# Altium project SlimeVR_REVTT.PrjPcb
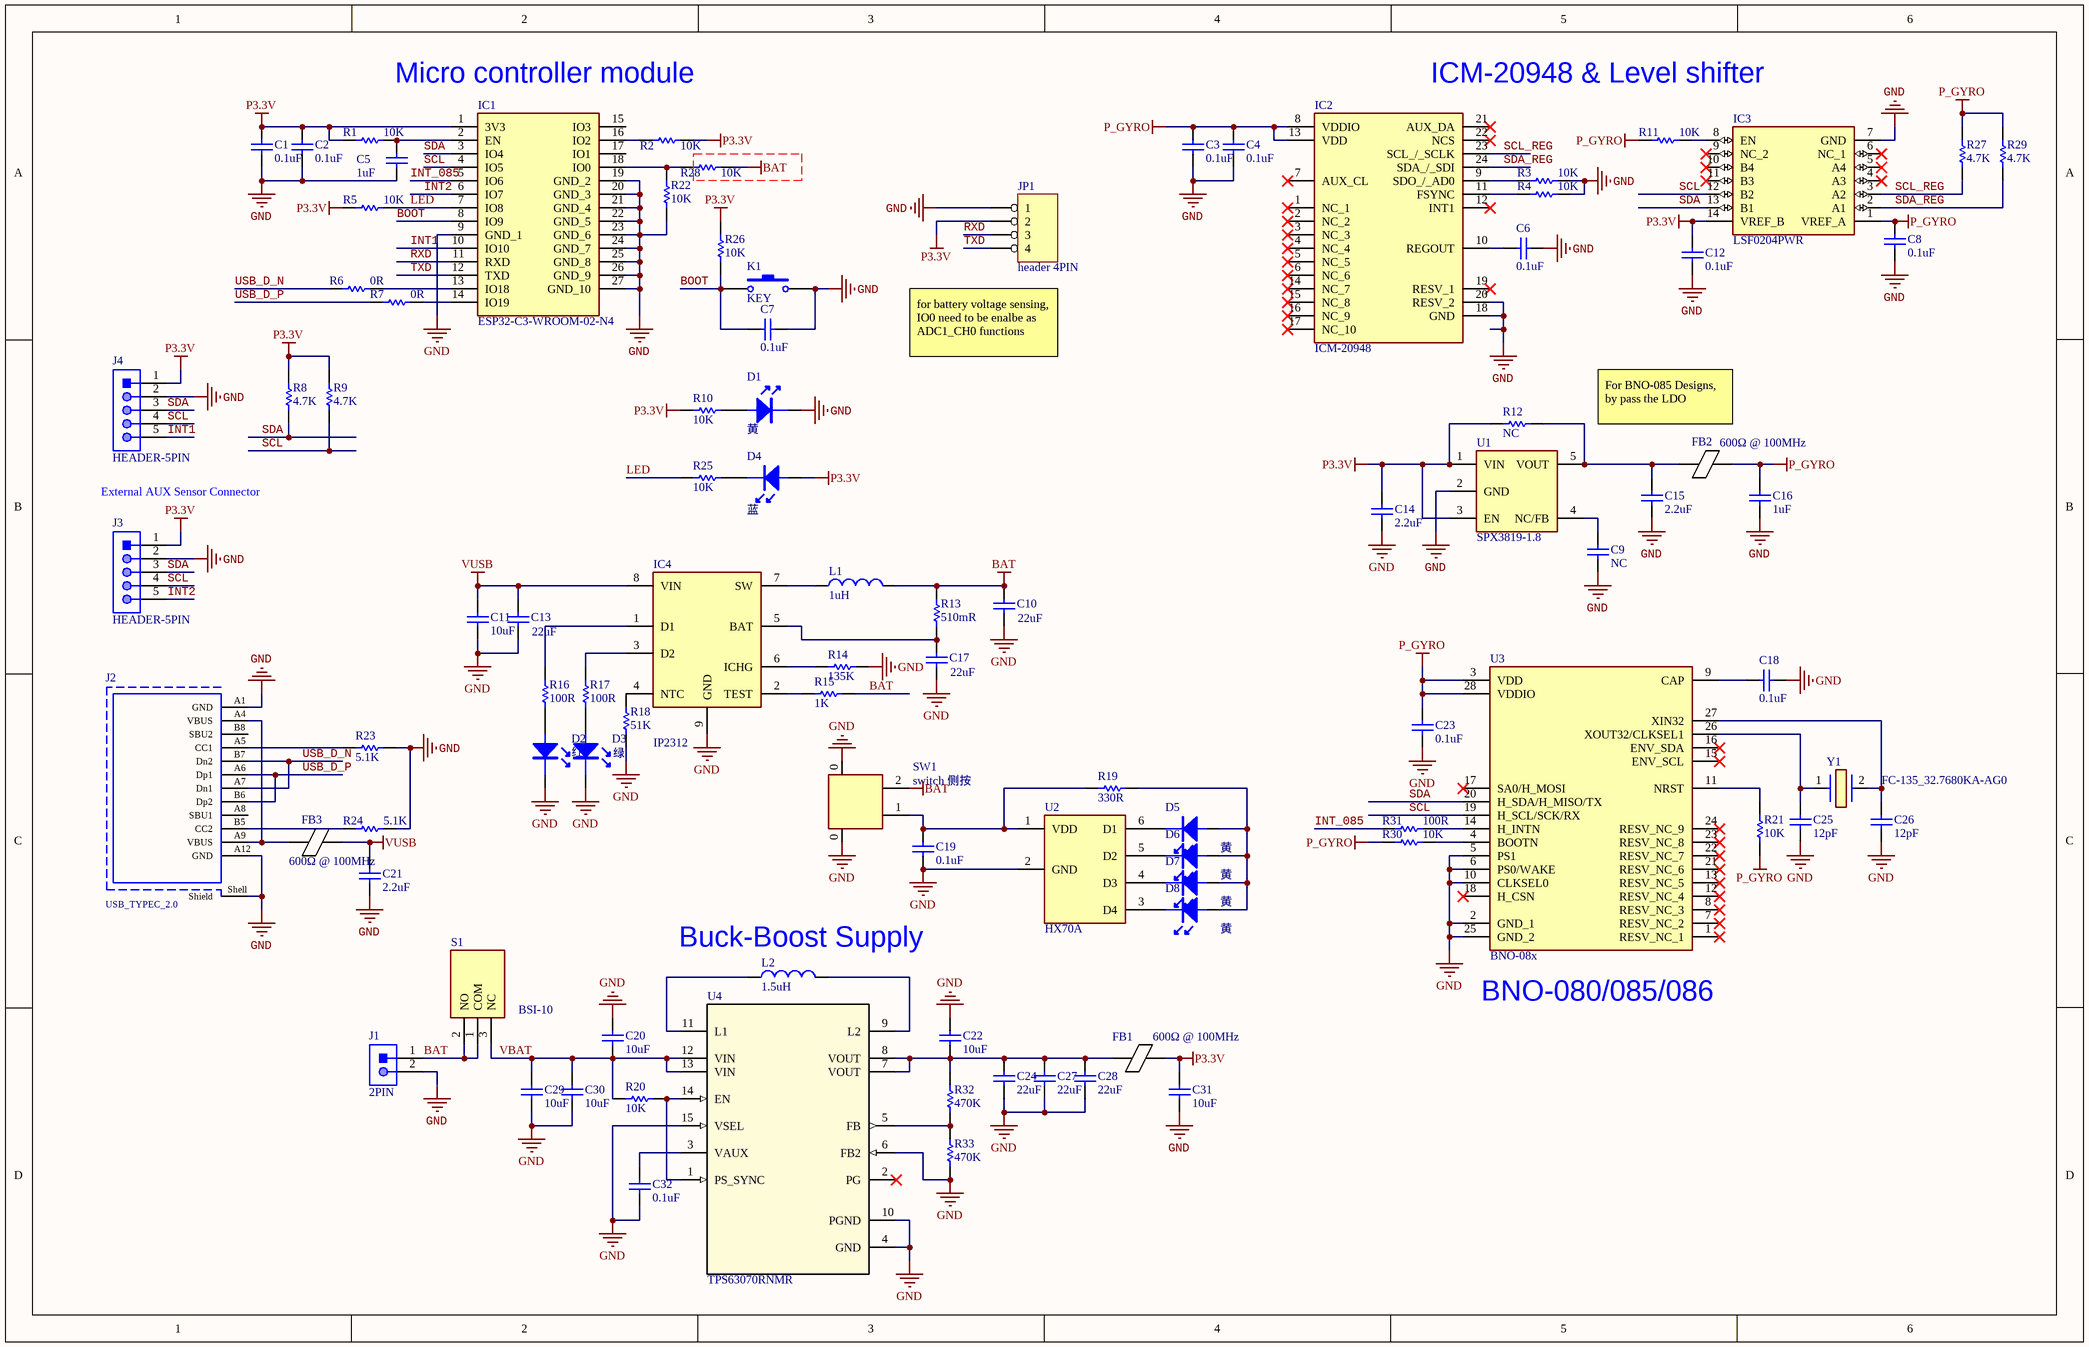
[diagram p0: SVR_REVTT_1.3.SchDoc]
1 sheet, 95 parts. Net scope: global (net labels, ports and power ports of the same name join across sheets).
Board file: SLMVRtt_REV1.3_MH.PcbDoc

## Sheet SVR_REVTT_1.3.SchDoc
size OrCAD B

### Parts
C1  0.1uF  [0402L]
C2  0.1uF  [0402L]
C3  0.1uF  [0402L]
C4  0.1uF  [0402L]
C5  1uF  [0402L]
C6  0.1uF  [0402L]
C7  0.1uF  [0402L]
C8  0.1uF  [0402L]
C9  NC  [0603_C]
C10  22uF  [0805]
C11  10uF  [0805]
C12  0.1uF  [0402L]
C13  22uF  [0805]
C14  2.2uF  [0603_C]
C15  2.2uF  [0603_C]
C16  1uF  [0603_C]
C17  22uF  [0805]
C18  0.1uF  [0402L]
C19  0.1uF  [0402L]
C20  10uF  [0603_C]
C21  2.2uF  [0603_C]
C22  10uF  [0603_C]
C23  0.1uF  [0402L]
C24  22uF  [0805]
C25  12pF  [0402L]
C26  12pF  [0402L]
C27  22uF  [0805]
C28  22uF  [0805]
C29  10uF  [0805]
C30  10uF  [0805]
C31  10uF  [0805]
C32  0.1uF  [0402L]
D1  黄  [0603_LED]
D2  红  [0603_LED]
D3  绿  [0603_LED]
D4  蓝  [0603_LED]
D5  黄  [0603_LED]
D6  黄  [0603_LED]
D7  黄  [0603_LED]
D8  黄  [0603_LED]
FB1  600Ω @ 100MHz  [0805]
FB2  600Ω @ 100MHz  [0603]
FB3  600Ω @ 100MHz  [0603]
IC1  ESP32-C3-WROOM-02-N4  [ESP32C3WROOM02N4]
IC2  ICM-20948  [QFN40P300X300X105-25N-D]
IC3  LSF0204PWR  [SOP65P640X120-14N]
IC4  IP2312  [SOIC-8N]
J1  2PIN  [XH2.54-WI-2P]
J2  USB_TYPEC_2.0  [USB_TYPEC_2.0_Horizontal_SMT]
J3  HEADER-5PIN  [HEADER_5P_1.25_RT]
J4  HEADER-5PIN  [HEADER_5P_1.25_RT]
JP1  header 4PIN  [header4]
K1  KEY  [KEY_2]
L1  value 1uH  [Inductor  SLO0650]  (hidden comment: INDUCTOR)
L2  value 1.5uH  [Inductor  SMNR4020]  (hidden comment: INDUCTOR)
R1  10K  [0402L]
R2  10K  [0402L]
R3  10K  [0402L]
R4  10K  [0402L]
R5  10K  [0402L]
R6  0R  [0402L]
R7  0R  [0402L]
R8  4.7K  [0402L]
R9  4.7K  [0402L]
R10  10K  [0402L]
R11  10K  [0402L]
R12  NC  [0603]
R13  510mR  [0603L]
R14  135K  [0402L]
R15  1K  [0402L]
R16  100R  [0402L]
R17  100R  [0402L]
R18  51K  [0402L]
R19  330R  [0603_R]
R20  10K  [0402L]
R21  10K  [0402L]
R22  10K  [0402L]
R23  5.1K  [0402L]
R24  5.1K  [0402L]
R25  10K  [0402L]
R26  10K  [0402L]
R27  4.7K  [0402L]
R28  10K  [0402L]
R29  4.7K  [0402L]
R30  10K  [0402L]
R31  100R  [0402L]
R32  470K  [0402L]
R33  470K  [0402L]
S1  BSI-10  [BSI10]
SW1  switch 侧按  [TSW 3*6*4.3-S-W]
U1  SPX3819-1.8  [SOT-23-5]
U2  HX70A  [SOT95P250X110-6N]
U3  BNO-08x  [BNO085]
U4  TPS63070RNMR  [RNM0015A]
Y1  FC-135_32.7680KA-AG0  [FC135327680KAAG0]

### Nets
BAT: C10.2 J1.1 L1.2 R13.2 R15.2 R28.2 S1.1(COM) S1.2(NO) SW1.2
GND: C1.1 C2.1 C3.2 C4.2 C5.1 C6.1 C7.2 C8.2 C9.1 C10.1 C11.1 C12.2 C13.1 C14.1 C15.1 C16.1 C17.1 C18.1 C19.1 C20.2 C21.1 C22.2 C23.1 C24.2 C25.1 C26.1 C27.2 C28.2 C29.1 C30.1 C31.1 C32.1 D1.1(K) D2.1(K) D3.1(K) IC1.9(GND_1) IC1.19(GND_2) IC1.20(GND_3) IC1.21(GND_4) IC1.22(GND_5) IC1.23(GND_6) IC1.24(GND_7) IC1.25(GND_8) IC1.26(GND_9) IC1.27(GND_10) IC2.18(GND) IC2.20(RESV_2) IC3.7(GND) IC4.9(GND) J1.2 J2.A1(GND) J2.A12(GND) J2.Shell(Shield) J3.2 J4.2 JP1.1 K1.2 R3.2 R4.2 R14.2 R18.1 R22.1 R23.2 R24.2 R33.1 SW1.0 U1.2(GND) U2.2(GND) U3.2(GND_1) U3.5(PS1) U3.6(PS0/WAKE) U3.10(CLKSEL0) U3.25(GND_2) U4.4(GND) U4.6(FB2) U4.10(PGND) U4.15(VSEL)
P3.3V: C1.2 C2.2 C12.1 C14.2 C31.2 D4.1(A) FB1.2 IC1.1(3V3) IC3.14(VREF_B) J3.1 J4.1 JP1.2 R1.1 R2.2 R5.1 R8.2 R9.2 R10.1 R12.2 R26.2 U1.1(VIN) U1.3(EN)
P_GYRO: C3.1 C4.1 C8.1 C16.2 C23.2 FB2.2 IC2.8(VDDIO) IC2.13(VDD) IC3.1(VREF_A) R11.1 R21.1 R27.2 R29.2 R30.1 U3.3(VDD) U3.28(VDDIO)
VUSB: C11.2 C13.2 C21.2 FB3.2 IC4.8(VIN)
BOOT: C7.1 IC1.8(IO9) K1.1 R26.1
INT1: IC1.10(IO10) J4.5
INT2: IC1.6(IO7) J3.5
INT_085: IC1.5(IO6) R31.1
LED: IC1.7(IO8) R5.2 R25.1
RXD: IC1.11(RXD) JP1.3
SCL: IC1.4(IO5) IC3.12(B2) J3.4 J4.4 R9.1 U3.19(H_SCL/SCK/RX)
SCL_REG: IC2.23(SCL_/_SCLK) IC3.3(A2) R27.1
SDA: IC1.3(IO4) IC3.13(B1) J3.3 J4.3 R8.1 U3.20(H_SDA/H_MISO/TX)
SDA_REG: IC2.24(SDA_/_SDI) IC3.2(A1) R29.1
TXD: IC1.12(TXD) JP1.4
USB_D_N: J2.A7(Dn1) J2.B7(Dn2) R6.1
USB_D_P: J2.A6(Dp1) J2.B6(Dp2) R7.1
VBAT: C20.1 C29.2 C30.2 R20.1 S1.3(NC) U4.12(VIN) U4.13(VIN)
NetC5_2: C5.2 IC1.2(EN) R1.2
NetC6_2: C6.2 IC2.10(REGOUT)
NetC9_2: C9.2 U1.4(NC/FB)
NetC15_2: C15.2 FB2.1 R12.1 U1.5(VOUT)
NetC17_2: C17.2 IC4.5(BAT) R13.1
NetC18_2: C18.2 U3.9(CAP)
NetC19_2: C19.2 R19.1 SW1.1 U2.1(VDD)
NetC22_1: C22.1 C24.1 C27.1 C28.1 FB1.1 R32.2 U4.7(VOUT) U4.8(VOUT)
NetC25_2: C25.2 U3.26(XOUT32/CLKSEL1) Y1.1
NetC26_2: C26.2 U3.27(XIN32) Y1.2(CRYSTAL_2)
NetC32_2: C32.2 U4.3(VAUX)
NetD1_2: D1.2(A) R10.2
NetD2_2: D2.2(A) R16.1
NetD3_2: D3.2(A) R17.1
NetD4_2: D4.2(A) R25.2
NetD5_1: D5.1(K) U2.6(D1)
NetD5_2: D5.2(A) D6.2(A) D7.2(A) D8.2(A) R19.2
NetD6_1: D6.1(K) U2.5(D2)
NetD7_1: D7.1(K) U2.4(D3)
NetD8_1: D8.1(K) U2.3(D4)
NetFB3_1: FB3.1 J2.A4(VBUS) J2.A9(VBUS)
NetIC1_13: IC1.13(IO18) R6.2
NetIC1_14: IC1.14(IO19) R7.2
NetIC1_16: IC1.16(IO2) R2.1
NetIC1_18: IC1.18(IO0) R22.2 R28.1
NetIC2_9: IC2.9(SDO_/_AD0) R3.1
NetIC2_11: IC2.11(FSYNC) R4.1
NetIC3_8: IC3.8(EN) R11.2
NetIC4_1: IC4.1(D1) R16.2
NetIC4_2: IC4.2(TEST) R15.1
NetIC4_3: IC4.3(D2) R17.2
NetIC4_4: IC4.4(NTC) R18.2
NetIC4_6: IC4.6(ICHG) R14.1
NetIC4_7: IC4.7(SW) L1.1
NetJ2_A5: J2.A5(CC1) R23.1
NetJ2_B5: J2.B5(CC2) R24.1
NetL2_1: L2.1 U4.11(L1)
NetL2_2: L2.2 U4.9(L2)
NetR20_2: R20.2 U4.1(PS_SYNC) U4.14(EN)
NetR21_2: R21.2 U3.11(NRST)
NetR30_2: R30.2 U3.4(BOOTN)
NetR31_2: R31.2 U3.14(H_INTN)
NetR32_1: R32.1 R33.2 U4.5(FB)

Not connected (* = marked no-connect by the designer): IC1 15(IO3) 17(IO1); IC2 1(NC_1)* 2(NC_2)* 3(NC_3)* 4(NC_4)* 5(NC_5)* 6(NC_6)* 7(AUX_CL)* 12(INT1)* 14(NC_7)* 15(NC_8)* 16(NC_9)* 17(NC_10)* 19(RESV_1)* 21(AUX_DA)* 22(NCS)*; IC3 4(A3)* 5(A4)* 6(NC_1)* 9(NC_2)* 10(B4)* 11(B3)*; J2 A8(SBU1) B8(SBU2); U3 1(RESV_NC_1)* 7(RESV_NC_2)* 8(RESV_NC_3)* 12(RESV_NC_4)* 13(RESV_NC_5)* 15(ENV_SCL)* 16(ENV_SDA)* 17(SA0/H_MOSI)* 18(H_CSN)* 21(RESV_NC_6)* 22(RESV_NC_7)* 23(RESV_NC_8)* 24(RESV_NC_9)*; U4 2(PG)*

### Notes on the sheet
- Micro controller module
- ICM-20948 & Level shifter
- (near JP1) for battery voltage sensing, IO0 need to be enalbe as ADC1_CH0 functions
- For BNO-085 Designs,
  by pass the LDO
- External AUX Sensor Connector
- (near L2) Buck-Boost Supply
- (near U3) BNO-080/085/086
- Title
- Size:
- Date:
- File:
- C
- Number:
- Time:
- Revision:
- Sheet
- of

### Library data of the parts
C1-C32 = CAP: Capacitor; Value: 104; Published: 8-Jun-2000; LatestRevisionDate: 17-Jul-2002; LatestRevisionNote: Re-released for DXP Platform.; PackageReference: RAD-0.3; Publisher: Altium Limited
D1-D8 = LED: LED 发光二极管
FB1-FB3 = FB: 磁珠 600Ω @ 100MHz
IC1 = ESP32-C3-WROOM-02-N4: Integrated Circuit; Manufacturer_Name: Espressif Systems; Datasheet Link: https://www.mouser.ch/datasheet/2/891/Espressif_ESP32_C3_WROOM_02-2006871.pdf; Height: 3.35mm; Manufacturer_Part_Number: ESP32-C3-WROOM-02-N4; Mouser Part Number: 356-ESP32C3WROOM02N4; Mouser Price/Stock: https://www.mouser.co.uk/ProductDetail/Espressif-Systems/ESP32-C3-WROOM-02-N4?qs=stqOd1AaK7%2FqjTZKEOgfUg%3D%3D
IC2 = ICM-20948: Integrated Circuit; Manufacturer_Name: TDK; Datasheet Link: https://product.tdk.com/system/files/dam/doc/product/sensor/mortion-inertial/imu/data_sheet/ds-000189-icm-20948-v1.3.pdf; Height: 1.05mm; Manufacturer_Part_Number: ICM-20948; Mouser Part Number: 410-ICM-20948; Mouser Price/Stock: https://www.mouser.co.uk/ProductDetail/TDK-InvenSense/ICM-20948?qs=u4fy%2FsgLU9OtGc31yF%2Friw%3D%3D; Arrow Part Number: ICM-20948; Arrow Price/Stock: https://www.arrow.com/en/products/icm-20948/invensense?region=nac
IC3 = LSF0204PWR: Integrated Circuit; Manufacturer_Name: Texas Instruments; Datasheet Link: http://www.ti.com/lit/gpn/lsf0204; Height: 1.2mm; Manufacturer_Part_Number: LSF0204PWR; Mouser Part Number: 595-LSF0204PWR; Mouser Price/Stock: https://www.mouser.co.uk/ProductDetail/Texas-Instruments/LSF0204PWR?qs=m%2F7bTylgptck0MkFZrWcVg%3D%3D; Arrow Part Number: LSF0204PWR; Arrow Price/Stock: https://www.arrow.com/en/products/lsf0204pwr/texas-instruments?region=nac
IC4 = IP2312: Integrated Circuit; Manufacturer_Name: INJOINIC; Datasheet Link: http://www.szjuquan.com/upload_files/qb_sell_/pdf/IP2312.pdf; Height: 1.65mm; Manufacturer_Part_Number: IP2312
J1 = HEADER 2PIN
J2 = USB_TYPEC_2.0: USB 3.1 Type C Receptacle WR-COM, Horizontal, SMT / THT; Part Number: 632723300011; Rated Current: 5 A; Contact Resistance: 30 mOhm; Working Voltage: 20 VDC; ComponentLink1Description: Manufacturer; ComponentLink1URL: http://www.we-online.de; ComponentLink2Description: Datasheet; ComponentLink2URL: https://katalog.we-online.de/em/datasheet/632723x00011%282%29.pdf; Published Date: September 2018; Publisher: Wurth Elektronik; Orientation: Horizontal; Connector Type: USB 3.1 Type C; Operating Temperature: -40 to 105 degC; Mounting Technology: SMT / THT; Gender: Receptacle; Packaging: Tape and Reel
JP1 = HEADER 4
K1 = KEY_2: Switch; Published: 24-Mar-1999; LatestRevisionDate: 17-Jul-2002; LatestRevisionNote: Re-released for DXP Platform.; PackageReference: SPST-2; Publisher: Altium Limited
L1 L2 = INDUCTOR: 电感; Code_IEC: 1005; Published: 8-Jun-2000; LatestRevisionDate: 17-Jul-2002; LatestRevisionNote: Re-released for DXP Platform.; PackageReference: 0402-A; Publisher: Altium Limited; Code_JEITA: 0402
R1-R14 R16-R33 = RES: Resistor; Value: 1K; Published: 8-Jun-2000; Revision: July-2002: Re-released for DXP Platform.; Publisher: Altium Limited
R15 = RES: Resistor; Published: 8-Jun-2000; Revision: July-2002: Re-released for DXP Platform.; Publisher: Altium Limited; Value: 1K
S1 = BSI-10: Switch; Manufacturer_Name: Sungmun; Datasheet Link: https://datasheet.datasheetarchive.com/originals/distributors/Datasheets-2/DSA-20618.pdf; Height: 6.4mm; Manufacturer_Part_Number: BSI-10
U1 = ADP150
U2 = HX70A: 单节锂电池电量指示芯片
U3 = BNO085: Accelerometer; Manufacturer_Name: Hillcrest Laboratories; Datasheet Link: https://www.hillcrestlabs.com/downloads/bno080-datasheet; Height: 1.18mm; Manufacturer_Part_Number: BNO085
U4 = TPS63070RNMR: Imported; Manufacturer: Texas Instruments; PartNumber: TPS63070RNMR; RefDes: RefDes; Type: TYPE; Value: Value
Y1 = FC-135_32.7680KA-AG0: Crystal or Oscillator; pin to pad: 1>none; Manufacturer_Name: Epson Timing; Manufacturer_Part_Number: FC-135 32.7680KA-AG0; Datasheet Link: https://support.epson.biz/td/api/doc_check.php?dl=brief_FC-135&lang=en/.pdf; Height: 0.9mm; Mouser Part Number: 732-FC135-32.76KAAG0; Mouser Price/Stock: https://www.mouser.co.uk/ProductDetail/Epson-Timing/FC-135-32.7680KA-AG0?qs=l3LL3yk8ONZCQSM4diwOUg%3D%3D; Arrow Part Number: FC-135 32.7680KA-AG0; Arrow Price/Stock: https://www.arrow.com/en/products/fc-13532.7680ka-ag0/epson-electronics-america?region=nac